# EAGLE design DAC (EAGLE 6.4)
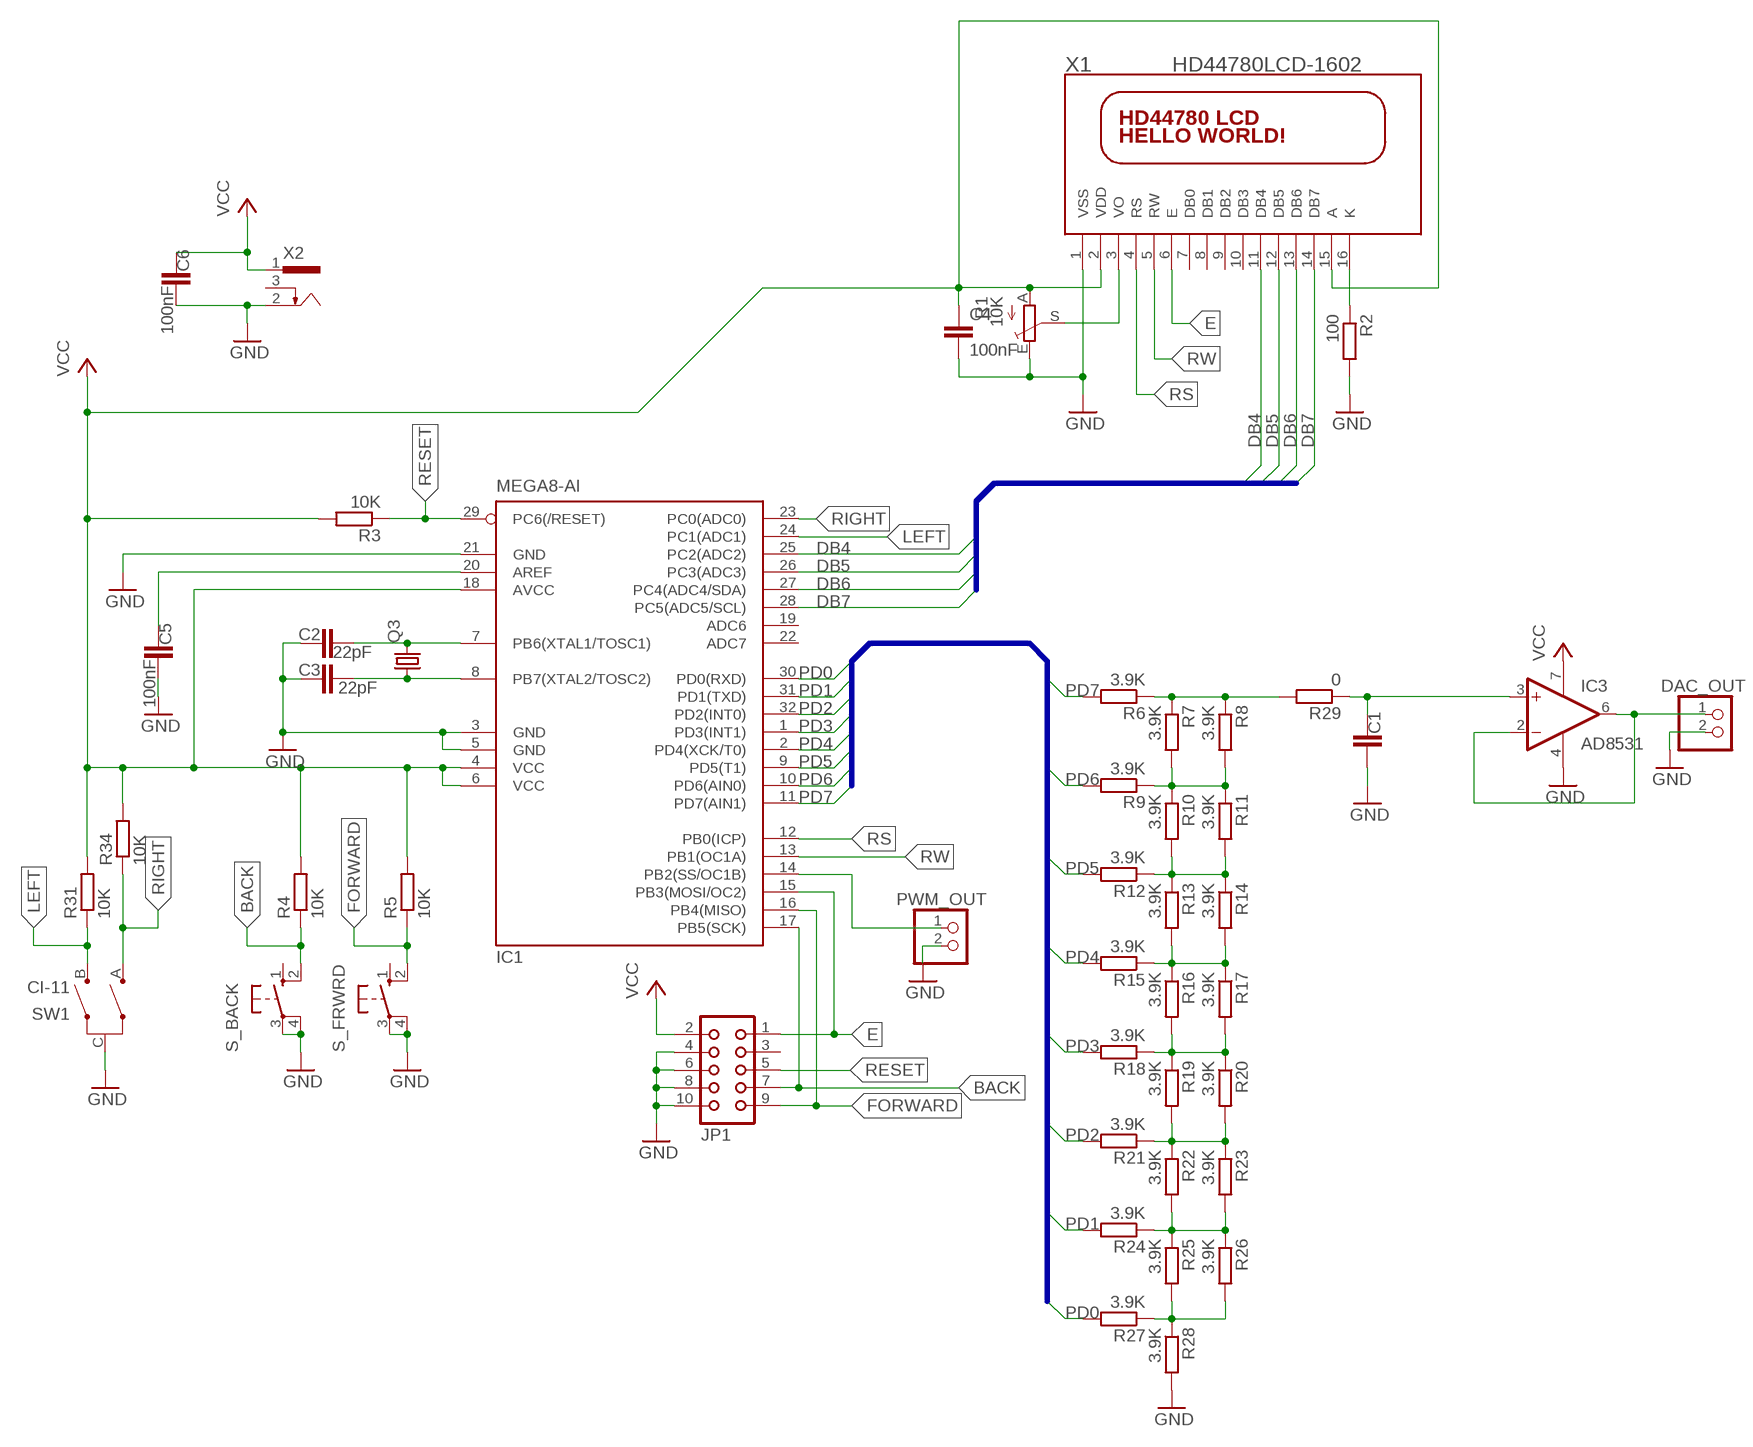
[diagram p0: schematic, sheet 1]

## Parts
C1  C-EUC1206  [C1206]
C2  22pF  C-EUC1206  [C1206]
C3  22pF  C-EUC1206  [C1206]
C4  100nF  C-EUC1206  [C1206]
C5  100nF  C-EUC1206  [C1206]
C6  100nF  C-EUC1206  [C1206]
DAC_OUT  PINHD-1X2_2.54-90°  [1X02/90]
IC1  MEGA8-AI  [TQFP32-08]
IC3  AD8531  MCP601SN  [SO08]
JP1  CON10L  [CON10L]
PWM_OUT  PINHD-1X2_2.54-90°  [1X02/90]
Q3  CRYSTALHC49U-V  [HC49U-V]
R1  10K  TRIM_EU-CA6V  [CA6V]
R2  100  R-EU_R1206  [R1206]
R3  10K  R-EU_R1206  [R1206]
R4  10K  R-EU_R1206  [R1206]
R5  10K  R-EU_R1206  [R1206]
R6  3.9K  R-EU_R1206  [R1206]
R7  3.9K  R-EU_R1206  [R1206]
R8  3.9K  R-EU_R1206  [R1206]
R9  3.9K  R-EU_R1206  [R1206]
R10  3.9K  R-EU_R1206  [R1206]
R11  3.9K  R-EU_R1206  [R1206]
R12  3.9K  R-EU_R1206  [R1206]
R13  3.9K  R-EU_R1206  [R1206]
R14  3.9K  R-EU_R1206  [R1206]
R15  3.9K  R-EU_R1206  [R1206]
R16  3.9K  R-EU_R1206  [R1206]
R17  3.9K  R-EU_R1206  [R1206]
R18  3.9K  R-EU_R1206  [R1206]
R19  3.9K  R-EU_R1206  [R1206]
R20  3.9K  R-EU_R1206  [R1206]
R21  3.9K  R-EU_R1206  [R1206]
R22  3.9K  R-EU_R1206  [R1206]
R23  3.9K  R-EU_R1206  [R1206]
R24  3.9K  R-EU_R1206  [R1206]
R25  3.9K  R-EU_R1206  [R1206]
R26  3.9K  R-EU_R1206  [R1206]
R27  3.9K  R-EU_R1206  [R1206]
R28  3.9K  R-EU_R1206  [R1206]
R29  0  R-EU_R1206  [R1206]
R31  10K  R-EU_R1206  [R1206]
R34  10K  R-EU_R1206  [R1206]
S_BACK  10-XX  [B3F-10XX]
S_FRWRD  10-XX  [B3F-10XX]
SW1  CI-11  [CI-11]
X1  HD44780LCD-1602  [LCD1602]
X2  733989-5  [733989-5]

## Nets
BACK: IC1.17(PB5(SCK)) JP1.7 R4.1 S_BACK.2(S1)
DB4: IC1.25(PC2(ADC2)) X1.11(DB4)
DB5: IC1.26(PC3(ADC3)) X1.12(DB5)
DB6: IC1.27(PC4(ADC4/SDA)) X1.13(DB6)
DB7: IC1.28(PC5(ADC5/SCL)) X1.14(DB7)
E: IC1.15(PB3(MOSI/OC2)) JP1.1 X1.6(E)
FORWARD: IC1.16(PB4(MISO)) JP1.9 R5.1 S_FRWRD.2(S1)
GND: C1.2 C2.1 C3.1 C4.2 C5.2 C6.2 DAC_OUT.2 IC1.3(GND) IC1.5(GND) IC1.21(GND) IC3.4(V-) JP1.4 JP1.6 JP1.8 JP1.10 PWM_OUT.2 R1.E R2.2 R28.2 S_BACK.3(P) S_BACK.4(P1) S_FRWRD.3(P) S_FRWRD.4(P1) SW1.C X1.1(VSS) X2.2
LEFT: IC1.24(PC1(ADC1)) R31.1 SW1.B
N$1: DAC_OUT.1 IC3.2(-IN) IC3.6(OUT)
N$3: C5.1 IC1.20(AREF)
N$4: C2.2 IC1.7(PB6(XTAL1/TOSC1)) Q3.2
N$5: R1.S X1.3(VO)
N$6: R6.1 R7.1 R8.1 R29.2
N$7: IC1.14(PB2(SS/OC1B)) PWM_OUT.1
N$8: R2.1 X1.16(K)
N$10: R7.2 R8.2 R9.1 R10.1 R11.1
N$12: R10.2 R11.2 R12.1 R13.1 R14.1
N$13: R13.2 R14.2 R15.1 R16.1 R17.1
N$14: R16.2 R17.2 R18.1 R19.1 R20.1
N$15: R19.2 R20.2 R21.1 R22.1 R23.1
N$16: R22.2 R23.2 R24.1 R25.1 R26.1
N$17: R25.2 R26.2 R27.1 R28.1
N$18: C1.1 IC3.3(+IN) R29.1
N$19: C3.2 IC1.8(PB7(XTAL2/TOSC2)) Q3.1
PD0: IC1.30(PD0(RXD)) R27.2
PD1: IC1.31(PD1(TXD)) R24.2
PD2: IC1.32(PD2(INT0)) R21.2
PD3: IC1.1(PD3(INT1)) R18.2
PD4: IC1.2(PD4(XCK/T0)) R15.2
PD5: IC1.9(PD5(T1)) R12.2
PD6: IC1.10(PD6(AIN0)) R9.2
PD7: IC1.11(PD7(AIN1)) R6.2
RESET: IC1.29(PC6(/RESET)) JP1.5 R3.1
RIGHT: IC1.23(PC0(ADC0)) R34.1 SW1.A
RS: IC1.12(PB0(ICP)) X1.4(RS)
RW: IC1.13(PB1(OC1A)) X1.5(RW)
VCC: C4.1 C6.1 IC1.4(VCC) IC1.6(VCC) IC1.18(AVCC) IC3.7(V+) JP1.2 R1.A R3.2 R4.2 R5.2 R31.2 R34.2 X1.2(VDD) X1.15(A) X2.1
Unconnected: IC1.19(ADC6) IC1.22(ADC7) JP1.3 S_BACK.1(S) S_FRWRD.1(S) X1.7(DB0) X1.8(DB1) X1.9(DB2) X1.10(DB3) X2.3

## Buses
PD0,PD1,PD2,PD3,PD4,PD5,PD6,PD7
VDD,RS,RW,E,DB4,DB5,DB6,DB7

## Library data of the parts
C1-C6 = rcl:C-EU: CAPACITOR, European symbol
DAC_OUT PWM_OUT = pinhead-1:PINHD-1X2: PIN HEADER
IC1 = atmel:MEGA8: MICROCONTROLLER 8 Kbytes FLASH, 1 kbytes SRAM, 512 bytes EEPROM, USART, 6-channel 10 bit ADC, 2-channel 8 bit ADC Pin compatible with Atmega48, ATMega88, ATMega168 Source: avr.lbr; MPN: ATMEGA8-16AU; OC_FARNELL: 9171371; OC_NEWARK: 73M8863
IC3 = linear:MCP601: Single Op Amp 2.7V to 6.0V Single Supply CMOS Source: http://ww1.microchip.com/downloads/en/DeviceDoc/21314g.pdf
JP1 = con-harting:CON10L: CONNECTOR; OC_FARNELL: unknown; OC_NEWARK: unknown
Q3 = crystal:CRYSTAL: CRYSTAL; OC_FARNELL: 1666969; OC_NEWARK: unknown
R1 = pot:TRIM_EU-: POTENTIOMETER
R2-R29 R31 R34 = rcl:R-EU_: RESISTOR, European symbol
S_BACK S_FRWRD = switch-omron:10-XX: OMRON SWITCH; MPN: B3F-1000; OC_FARNELL: 176432; OC_NEWARK: 36M3542
SW1 = encoder:CI-11: 11mm Incemental Encoder Source: www.piher.net .. 04-CI-11v04.pdf; OC_FARNELL: unknown; OC_NEWARK: unknown
X1 = adafruit:HD44780LCD: HD44780 LCD Standard character type LCDs, available in sizes from 8x1 to 40x4!
X2 = con-conrad:73398?: FEMALE PRINT CONNECTOR Niedervolt-Steckverbinder Distributor Conrad

## Board
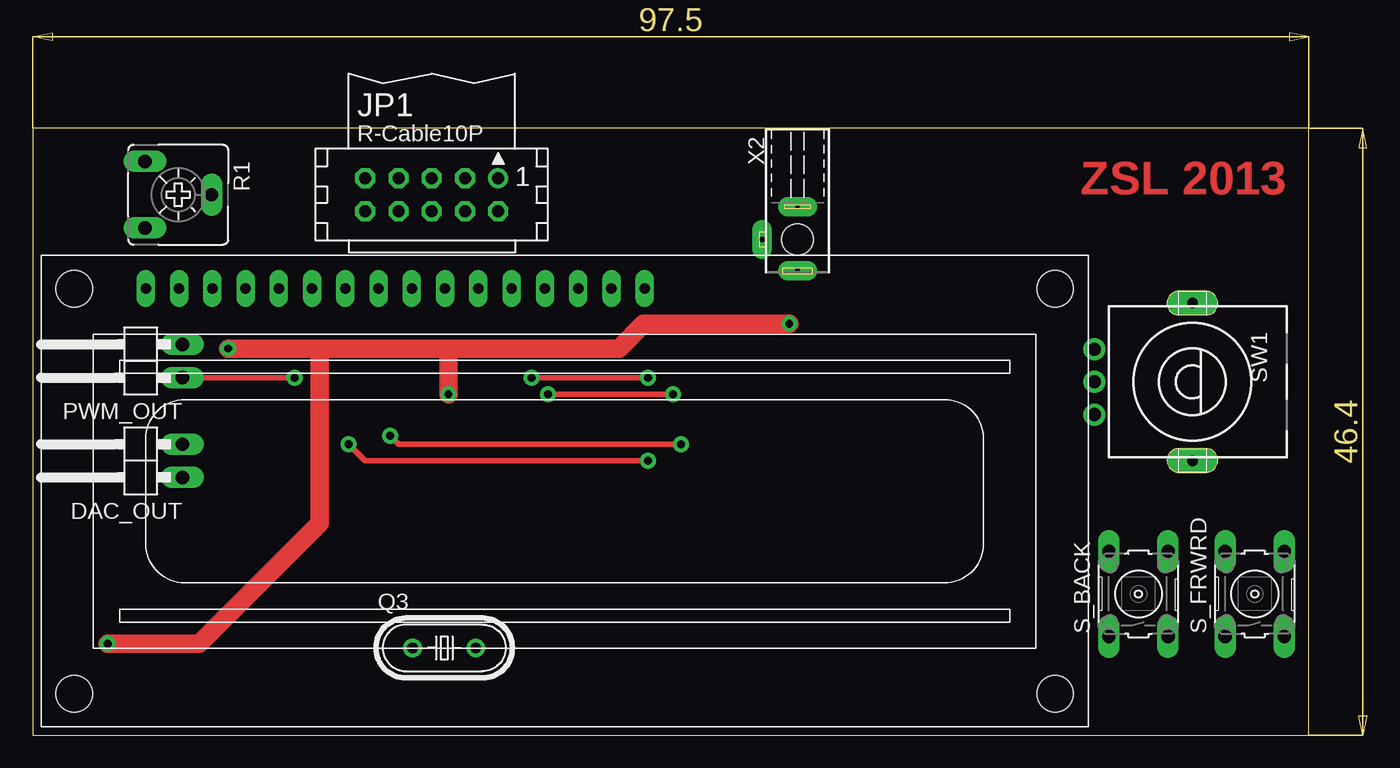
[diagram p1: board, top side]
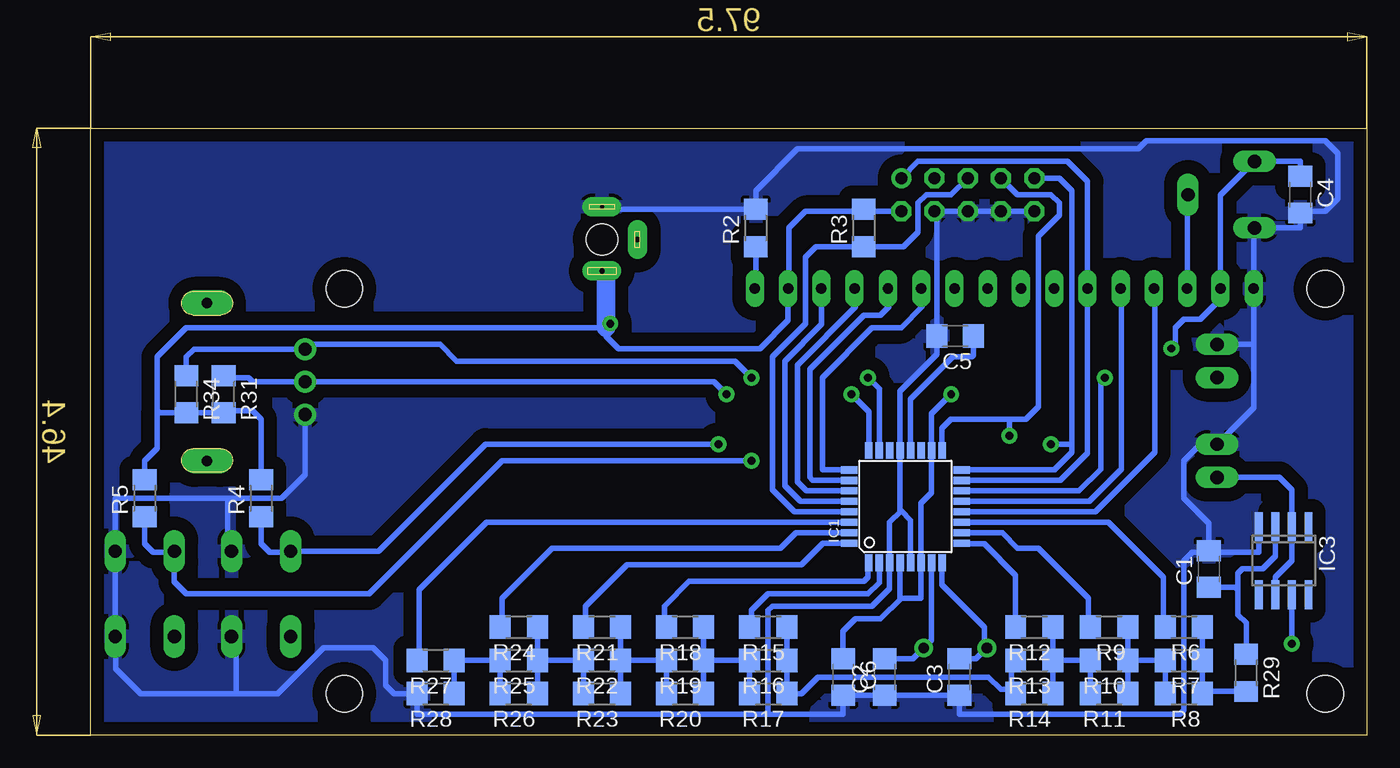
[diagram p2: board, bottom side, seen from below]

Size 97.46 x 46.34 mm. Coordinates in mm from the lower left corner, seen from the top.
Outline: 0,0 97.46,0 97.46,46.34 0,46.34 0,0
Copper layers (1*16): Top 0.035mm / dielectric 1.5mm / Bottom 0.035mm
Design rules "default *": minimum track width 16mil, minimum drill 24mil, track to track 8mil, track to pad 8mil, pad to pad 8mil, via to via 8mil, smd to smd 8mil, copper to edge 40mil, drill to drill 40mil, minimum pad ring 12mil, minimum via ring 12mil, stop-mask expansion 4mil, vias tented up to drill 0mil, thermal gap 10mil

### Footprints (pad centres in the part's own frame; a part is rotated, then mirrored left to right if it is on the bottom)
C1206 = smd 1.6 x 1.8: 1 -1.4,0; 2 1.4,0
1X02/90 = drill 1.016 long: 1 -2.54,-3.81; 2 0,-3.81
TQFP32-08 = smd 1.27 x 0.559: 1 -4.293,2.8; 2 -4.293,2; 3 -4.293,1.2; 4 -4.293,0.4; 5 -4.293,-0.4; 6 -4.293,-1.2; 7 -4.293,-2; 8 -4.293,-2.8; 17 4.293,-2.8; 18 4.293,-2; 19 4.293,-1.2; 20 4.293,-0.4; 21 4.293,0.4; 22 4.293,1.2; 23 4.293,2; 24 4.293,2.8 | smd 0.559 x 1.27: 9 -2.8,-4.293; 10 -2,-4.293; 11 -1.2,-4.293; 12 -0.4,-4.293; 13 0.4,-4.293; 14 1.2,-4.293; 15 2,-4.293; 16 2.8,-4.293; 25 2.8,4.293; 26 2,4.293; 27 1.2,4.293; 28 0.4,4.293; 29 -0.4,4.293; 30 -1.2,4.293; 31 -2,4.293; 32 -2.8,4.293
SO08 = smd 0.6 x 2.2: 1 -1.905,-2.6; 2 -0.635,-2.6; 3 0.635,-2.6; 4 1.905,-2.6; 5 1.905,2.6; 6 0.635,2.6; 7 -0.635,2.6; 8 -1.905,2.6
CON10L = drill 0.914: 1 5.08,1.27 | drill 0.914 octagon: 2 5.08,-1.27; 3 2.54,1.27; 4 2.54,-1.27; 5 0,1.27; 6 0,-1.27; 7 -2.54,1.27; 8 -2.54,-1.27; 9 -5.08,1.27; 10 -5.08,-1.27
HC49U-V = drill 0.813: 1 -2.413,0; 2 2.413,0
CA6V = drill 1.016 long: A -2.54,-2.54; E 2.54,-2.54; S 0,2.54
R1206 = smd 1.6 x 1.803: 1 -1.422,0; 2 1.422,0
B3F-10XX = drill 1.016 long: 1 -3.251,2.261; 2 3.251,2.261; 3 -3.251,-2.261; 4 3.251,-2.261
CI-11 = drill 1 pad 1.676: A -2.5,-7.5; B 0,-7.5; C 2.5,-7.5 | drill 0.8 pad 1.93 long: P$2 -6.032,0; P$3 6.032,0
LCD1602 = drill 0.8 long: 1 8,33.46; 2 10.54,33.46; 3 13.08,33.46; 4 15.62,33.46; 5 18.16,33.46; 6 20.7,33.46; 7 23.24,33.46; 8 25.78,33.46; 9 28.32,33.46; 10 30.86,33.46; 11 33.4,33.46; 12 35.94,33.46; 13 38.48,33.46; 14 41.02,33.46; 15 43.56,33.46; 16 46.1,33.46 | hole 2.8: 2.54,2.54; 2.54,33.46; 77.46,33.46; 77.46,2.54
733989-5 = drill 0.4 pad 1.5 long: 1 0,5.82; 3 2.7,3.42 | drill 0.3 pad 1.5 long: 2 0,0.92 | hole 2.4: 0,3.42

### Placement (x,y rotation side)
C1  12.06,12.7 90 bottom
C2  36.83,4.45 90 bottom
C3  31.11,4.45 90 bottom
C4  5.08,41.27 270 bottom
C5  31.43,30.48 180 bottom
C6  40.01,4.45 270 bottom
DAC_OUT  7.62,22.23 90 top
IC1  35.24,17.46 90 bottom
IC3  6.35,13.34 180 bottom
JP1  30.48,41.27 0 top
PWM_OUT  7.62,29.84 90 top
Q3  31.43,6.67 0 top
R1  11.11,41.27 270 top
R2  46.67,38.73 90 bottom
R3  38.42,38.73 90 bottom
R4  84.45,18.1 90 bottom
R5  93.34,18.1 90 bottom
R6  13.97,8.26 180 bottom
R7  13.97,5.71 180 bottom
R8  13.97,3.17 180 bottom
R9  19.68,8.26 180 bottom
R10  19.68,5.71 180 bottom
R11  19.68,3.17 180 bottom
R12  25.4,8.26 180 bottom
R13  25.4,5.71 180 bottom
R14  25.4,3.17 180 bottom
R15  45.72,8.26 180 bottom
R16  45.72,5.71 180 bottom
R17  45.72,3.17 180 bottom
R18  52.07,8.26 180 bottom
R19  52.07,5.71 180 bottom
R20  52.07,3.17 180 bottom
R21  58.42,8.26 180 bottom
R22  58.42,5.71 180 bottom
R23  58.42,3.17 180 bottom
R24  64.77,8.26 180 bottom
R25  64.77,5.71 180 bottom
R26  64.77,3.17 180 bottom
R27  71.12,5.71 180 bottom
R28  71.12,3.17 180 bottom
R29  9.21,4.76 270 bottom
R31  87.31,26.04 270 bottom
R34  90.17,26.04 270 bottom
S_BACK  84.45,10.79 90 top
S_FRWRD  93.34,10.79 90 top
SW1  88.58,26.99 270 top
X1  0.64,0.64 0 top
X2  58.42,41.27 180 top

### Tracks (layer width: path | path; a pad name or v marks a point on that pad's centre or on a via)
BACK  (via drill 0.6)
  Top 0.406: v49.53,22.23 27.94,22.23 v27.3,22.86
  Bottom 0.406: JP1.7 26.67,41.27 24.13,41.27 23.5,40.64 23.5,39.69 25.08,38.1 25.08,25.08 26.04,24.13 27.3,24.13 | 84.14,17.11 R4.1 84.45,14.61 83.82,13.97 82.27,13.97 S_BACK.2 75.49,14.05 67.31,22.23 v49.53,22.23 | IC1.17 32.44,23.44 31.75,24.13 27.3,24.13 | v27.3,22.86 27.3,24.13
DB4
  Bottom 0.406: IC1.25 41.53,20.26 41.59,20.32 41.59,27.3 37.78,31.11 35.56,31.11 33.97,32.7 33.97,34.03 X1.11
DB5
  Bottom 0.406: IC1.26 42.32,19.46 42.55,19.68 42.55,27.94 38.42,32.07 37.15,32.07 36.51,32.7 36.51,34.03 X1.12
DB6
  Bottom 0.406: IC1.27 42.79,18.66 43.5,19.37 43.5,28.26 39.05,32.7 39.05,34.03 X1.13
DB7
  Bottom 0.406: X1.14 41.66,31.37 44.45,28.57 44.45,19.05 43.26,17.86 IC1.28
E
  Bottom 0.406: JP1.1 34.29,43.81 22.86,43.81 21.34,42.29 X1.6 21.34,21.53 23.4,19.46 IC1.15
FORWARD  (via drill 0.6)
  Top 0.406: v46.99,20.95 25.4,20.95 v24.13,22.23
  Bottom 0.406: JP1.9 23.5,42.55 22.54,41.59 22.54,22.23 | 22.54,22.23 22.54,21.59 23.81,20.32 23.81,20.26 IC1.16 | R5.1 93.34,14.61 92.71,13.97 91.16,13.97 S_FRWRD.2 91.08,11.71 90.17,10.79 76.2,10.79 66.04,20.95 v46.99,20.95 | v24.13,22.23 22.54,22.23
GND
  Bottom 0.406: JP1.10 JP1.8 JP1.6 JP1.4 32.83,39.82 C5.2 32.83,29.08 35.64,26.27 IC1.21 35.64,17.23 35.56,17.14 | 35.56,17.14 34.84,16.43 IC1.5 | 35.56,17.14 36.44,16.26 IC1.3 36.44,11.18 37.78,9.84 45.4,9.84 45.72,9.53 45.72,1.59 | 45.72,1.59 40.01,1.59 C6.2 C2.1 C3.1 31.11,1.59 14.29,1.59 13.97,1.91 13.97,13.34 13.34,13.97 11.94,13.97 | 45.72,1.59 72.54,1.59 R28.2 74.3,3.17 74.93,3.81 74.93,5.71 75.88,6.67 79.69,6.67 83.19,3.17 86.36,3.17 | IC3.4 8.26,13.97 11.94,13.97 | 11.94,13.97 C1.2 12.06,16.19 13.97,18.1 13.97,20.95 12.7,22.23 DAC_OUT.2 8.63,25.02 8.63,29.84 | 8.63,29.84 X1.1 8.63,38.67 R1.E 5.08,38.73 C4.2 4.95,40.01 3.17,40.01 2.22,40.96 2.22,44.45 3.17,45.4 16.83,45.4 17.46,44.77 43.5,44.77 46.67,41.59 R2.2 58.22,40.16 X2.2 | PWM_OUT.2 8.63,29.84 | SW1.C 81.08,19.88 82.87,18.1 87,18.1 | 87,18.1 95.57,18.1 95.61,18.06 S_FRWRD.4 S_FRWRD.3 95.57,7.51 95.57,5.08 93.66,3.17 86.36,3.17 | S_BACK.4 87,14.33 87,18.1 | S_BACK.3 86.36,7.54 86.36,3.17
  pour Bottom (isolate 1.016): 0,46.35 0,0 97.47,0 97.47,46.35
LEFT  (via drill 0.6)
  Top 0.406: v39.37,26.04 v48.9,26.04
  Bottom 0.406: R31.1 87.16,27.3 85.41,27.3 85.09,26.99 SW1.B 49.85,26.99 v48.9,26.04 | IC1.24 38.04,24.71 v39.37,26.04
N$1
  Bottom 0.406: IC3.6 6.99,12.06 5.71,13.34 IC3.2 5.71,18.73 6.67,19.68 DAC_OUT.1
N$3
  Bottom 0.406: IC1.20 34.84,25.67 31.62,28.89 30.16,28.89 30.03,29.02 C5.1
N$4
  Bottom 0.406: IC1.7 33.24,7.27 Q3.2 34.67,5.84 C2.2
N$5
  Bottom 0.406: X1.3 13.71,41.27 R1.S
N$6
  Bottom 0.406: R8.1 12.38,3.34 | 12.38,3.34 R29.2 | 12.38,3.34 12.55,3.34 R7.1 R6.1
N$7  (via drill 0.6)
  Top 0.406: v20,27.3 PWM_OUT.1
  Bottom 0.406: IC1.14 21.98,18.66 20.32,20.32 20.32,26.99 v20,27.3
N$8
  Bottom 0.406: X1.16 46.67,34.16 R2.1
N$10
  Bottom 0.406: R11.1 R10.1 | R10.1 R9.1 | R10.1 R7.2 R8.2
N$11
  cutout Bottom: 31.75,20.95 31.75,13.97 38.73,13.97 38.73,20.95
N$12
  Bottom 0.406: R14.1 R13.1 | R13.1 R12.1 | R13.1 R10.2 R11.2
N$13
  Bottom 0.406: 44.45,3.17 R17.1 | R15.1 R16.1 R17.1 | R17.1 43.18,3.17 41.91,4.45 28.89,4.45 27.94,3.49 27.14,3.49 | 27.14,3.49 R14.2 | 27.14,3.49 27.14,5.4 R13.2
N$14
  Bottom 0.406: R20.1 R19.1 | R19.1 R18.1 | R19.1 R16.2 R17.2
N$15
  Bottom 0.406: R23.1 R22.1 | R22.1 R21.1 | R22.1 R19.2 R20.2
N$16
  Bottom 0.406: R24.1 R25.1 | R25.1 R26.1 | R23.2 R22.2 R25.1
N$17
  Bottom 0.406: R28.1 R27.1 R25.2 R26.2
N$18
  Bottom 0.406: IC3.3 6.99,13.65 7.94,12.7 9.53,12.7 9.84,12.38 9.84,11.11 | 9.84,11.11 9.84,9.21 9.21,8.57 R29.1 | C1.1 10.03,11.3 9.84,11.11
N$19
  Bottom 0.406: IC1.8 32.44,11.49 29.21,8.26 29.21,6.86 Q3.1 29.84,5.84 C3.2
N$20
  cutout Bottom: 3.81,11.43 8.89,11.43 8.89,15.24 3.81,15.24
PD0
  Bottom 0.406: R27.2 72.39,5.87 72.39,11.11 67.24,16.26 IC1.30
PD1
  Bottom 0.406: R24.2 66.04,8.41 66.04,10.48 62.23,14.29 44.77,14.29 43.59,15.46 IC1.31
PD2
  Bottom 0.406: IC1.32 41.53,14.66 43.18,13.02 56.52,13.02 59.69,9.84 59.69,8.41 R21.2
PD3
  Bottom 0.406: R18.2 53.66,8.42 53.66,9.84 51.75,11.75 38.42,11.75 38.1,12.06 38.1,13.11 IC1.1
PD4
  Bottom 0.406: IC1.2 37.24,11.65 38.1,10.79 45.72,10.79 46.99,9.53 46.99,8.41 R15.2
PD5
  Bottom 0.406: R12.2 26.82,12.22 29.21,14.61 30.89,14.61 IC1.9
PD6
  Bottom 0.406: IC1.10 27.84,15.46 26.67,14.29 25.08,14.29 21.27,10.48 21.27,8.42 R9.2
PD7
  Bottom 0.406: IC1.11 19.75,16.26 15.56,12.06 15.56,8.42 R6.2
RESET
  Bottom 0.406: JP1.5 31.75,41.27 33.66,41.27 34.29,40.64 34.29,38.42 35.4,37.31 R3.1 42.06,37.31 42.86,36.51 42.86,31.43 45.4,28.89 45.4,18.73 43.73,17.06 IC1.29
RIGHT  (via drill 0.6)
  Top 0.406: v38.1,27.3 v46.99,27.3
  Bottom 0.406: R34.1 90.17,28.89 89.58,29.49 SW1.A 80.72,29.84 70.8,29.84 69.53,28.57 48.26,28.57 v46.99,27.3 | IC1.23 37.24,26.45 v38.1,27.3
RS
  Bottom 0.406: IC1.12 20.72,17.06 16.19,21.59 16.19,34.03 X1.4
RW
  Bottom 0.406: IC1.13 21.19,17.86 18.73,20.32 18.73,27.94 18.73,28.26 18.73,34.03 X1.5
VCC  (via drill 0.6)
  Top 1.422: 31.75,29.53 44.77,29.53 46.67,31.43 v57.78,31.43 | v31.75,26.04 31.75,29.53 | v5.71,6.99 12.7,6.99 21.91,16.19 21.91,29.53 | v14.92,29.53 21.91,29.53 | 21.91,29.53 31.75,29.53
  Bottom 0.406: 35.56,10.48 34.04,10.48 IC1.6 34.04,17.71 33.24,18.51 IC1.18 33.24,24.54 v31.75,26.04 | 35.56,10.48 arc90 35.64,10.56 IC1.4 | C6.1 40.01,7.94 39.05,8.89 37.15,8.89 35.56,10.48 | 43.98,34.31 X1.15 | R3.2 38.27,40.01 | 38.27,40.01 JP1.2 | X1.15 44.13,34.16 44.13,38.73 42.86,40.01 38.27,40.01 | C4.1 5.08,43.81 R1.A 11.18,41.21 X1.2 11.18,33.27 12.7,31.75 13.97,31.75 14.61,31.11 14.61,29.84 v14.92,29.53 | R4.2 84.45,24.13 85.09,24.77 87.16,24.77 R31.2 R34.2 92.24,24.61 92.39,24.77 | X1.15 44.2,31.69 46.35,29.53 57.15,29.53 58.1,30.48 58.1,31.11 | 58.1,35.14 X2.1 | v57.78,31.43 58.1,31.11 | IC3.7 v5.71,6.99 | R5.2 93.34,20.95 92.39,21.91 92.39,24.77 | 58.1,31.11 90.17,31.11 92.39,28.89 92.39,24.77
  Bottom 1.422: 58.1,31.11 58.1,35.14

### Text on the board
Top: ZSL 2013